# Altium schematic sheet DC_DC_4V.SchDoc
size Tabloid
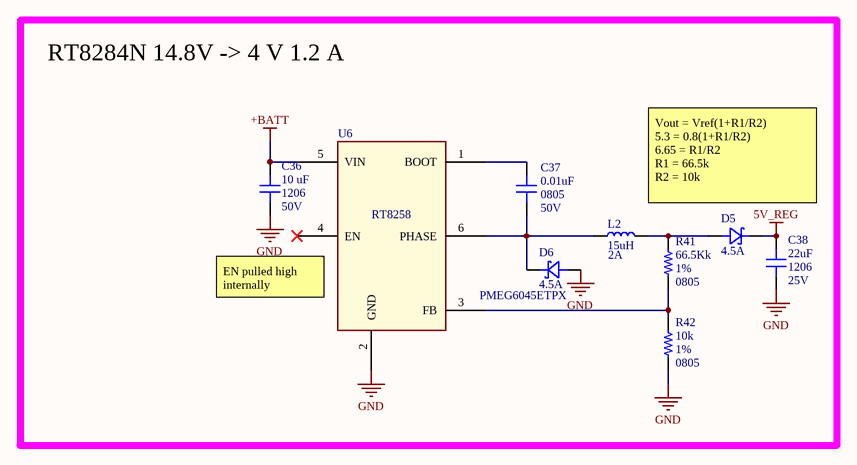
[diagram p0: DC_DC_4V.SchDoc]

## Parts
C36  value 10 uF  Package: 1206  Voltage: 50V  [CAP_1206]  (hidden comment: CAP - 1206)
C37  value 0.01uF  Package: 0805  Voltage: 50V  [CAP_0805]  (hidden comment: CAP - 0805)
C38  value 22uF  Package: 1206  Voltage: 25V  [CAP_1206]  (hidden comment: CAP - 1206)
D5  Current: 4.5A  [DO-214AC_SOD128]  (hidden comment: SCHOTTKEY)
D6  Current: 4.5A  Part number: PMEG6045ETPX  [DO-214AC_SOD128]  (hidden comment: SCHOTTKEY)
L2  value 15uH  Current: 2A  [NR5040T150M]  (hidden comment: IND)
R41  value 66.5Kk  Tolerance: 1%  Package: 0805  [FER_0805]  (hidden comment: RES - 0805)
R42  value 10k  Tolerance: 1%  Package: 0805  [FER_0805]  (hidden comment: RES - 0805)
U6  RT8258  [SOT23-6]  (value not drawn)

## Blocks framed on the sheet
RT8284N 14.8V -> 4 V 1.2 A: C36-C38 D5 D6 L2 R41 R42 U6

## Nets
5V_REG: C38.1 D5.2
+BATT: C36.1 U6.5(VIN)
GND: C36.2 C38.2 D6.1 R42.2 U6.2(GND)
NetC37_1: C37.1 U6.1(BOOT)
NetC37_2: C37.2 D6.2 L2.1 U6.6(PHASE)
NetD5_1: D5.1 L2.2 R41.1
NetR41_2: R41.2 R42.1 U6.3(FB)

Not connected (* = marked no-connect by the designer): U6 4(EN)*

## Notes on the sheet
- Vout = Vref(1+R1/R2)
  5.3 = 0.8(1+R1/R2)
  6.65 = R1/R2
  R1 = 66.5k
  R2 = 10k
- (near U6) EN pulled high internally
- Sheet Name
- Project Title
- Global Project
- Size
- Group
- Revision
- Date
- Sheet
- of
- Filename
- Designers

## Library data of the parts
C36 = CAP - 1206: Part number: GRT31CR61H106ME01L
C37 = CAP - 0805: Part number: CL21B103KBANNNC
C38 = CAP - 1206: Part number: CL31A226KAHNNNE
D5 = SCHOTTKEY: Part number: PMEG6045ETPX; Vf: Vf =0.33V
D6 = SCHOTTKEY: Vf: Vf =0.33V
R41 = RES - 0805: Part number: RC0805FR-0766K5L; Watt: ? W
R42 = RES - 0805: Part number: RMCF0805FT10K0; Watt: ? W
L2 = IND: Package: ?; Part number: NR5040T150M
U6 = RT8258: Part number: RT8258